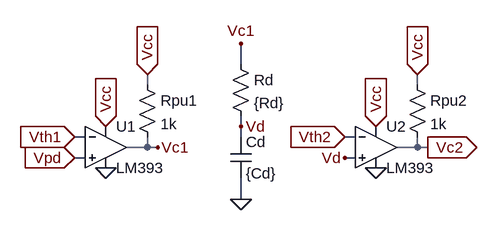
[diagram p0: schematic delay.asc]
delay.asc, the LTspice schematic file:
Version 4
SHEET 1 880 680
WIRE 192 96 192 64
WIRE 48 128 48 112
WIRE 464 128 464 112
WIRE 192 192 192 176
WIRE -48 208 -64 208
WIRE 192 208 192 192
WIRE 368 208 352 208
WIRE 48 224 48 208
WIRE 48 224 16 224
WIRE 64 224 48 224
WIRE 464 224 464 208
WIRE 464 224 432 224
WIRE 480 224 464 224
WIRE -48 240 -64 240
WIRE 368 240 352 240
WIRE 192 304 192 272
FLAG -16 256 0
FLAG -16 192 Vcc
IOPIN -16 192 In
FLAG -64 208 Vth1
IOPIN -64 208 In
FLAG -64 240 Vpd
IOPIN -64 240 In
FLAG 64 224 Vc1
FLAG 48 112 Vcc
IOPIN 48 112 In
FLAG 400 256 0
FLAG 400 192 Vcc
IOPIN 400 192 In
FLAG 352 240 Vd
FLAG 464 112 Vcc
IOPIN 464 112 In
FLAG 192 304 0
FLAG 192 64 Vc1
FLAG 192 192 Vd
FLAG 352 208 Vth2
IOPIN 352 208 In
FLAG 480 224 Vc2
IOPIN 480 224 Out
SYMBOL OpAmps\\opamp2 -16 160 R0
SYMATTR InstName U1
SYMATTR Value LM393
SYMBOL res 32 112 R0
SYMATTR InstName Rpu1
SYMATTR Value 1k
SYMBOL OpAmps\\opamp2 400 160 R0
SYMATTR InstName U2
SYMATTR Value LM393
SYMBOL res 448 112 R0
SYMATTR InstName Rpu2
SYMATTR Value 1k
SYMBOL res 176 80 R0
SYMATTR InstName Rd
SYMATTR Value {Rd}
SYMBOL cap 176 208 R0
SYMATTR InstName Cd
SYMATTR Value {Cd}

The netlist it stands for:
* delay.asc
XU1 Vpd Vth1 Vcc 0 Vc1 LM393  ; pins In+ In- V+ V- OUT
Rpu1 Vcc Vc1 1k
XU2 Vd Vth2 Vcc 0 Vc2 LM393  ; pins In+ In- V+ V- OUT
Rpu2 Vcc Vc2 1k
Rd Vc1 Vd {Rd}
Cd Vd 0 {Cd}
.backanno
.end